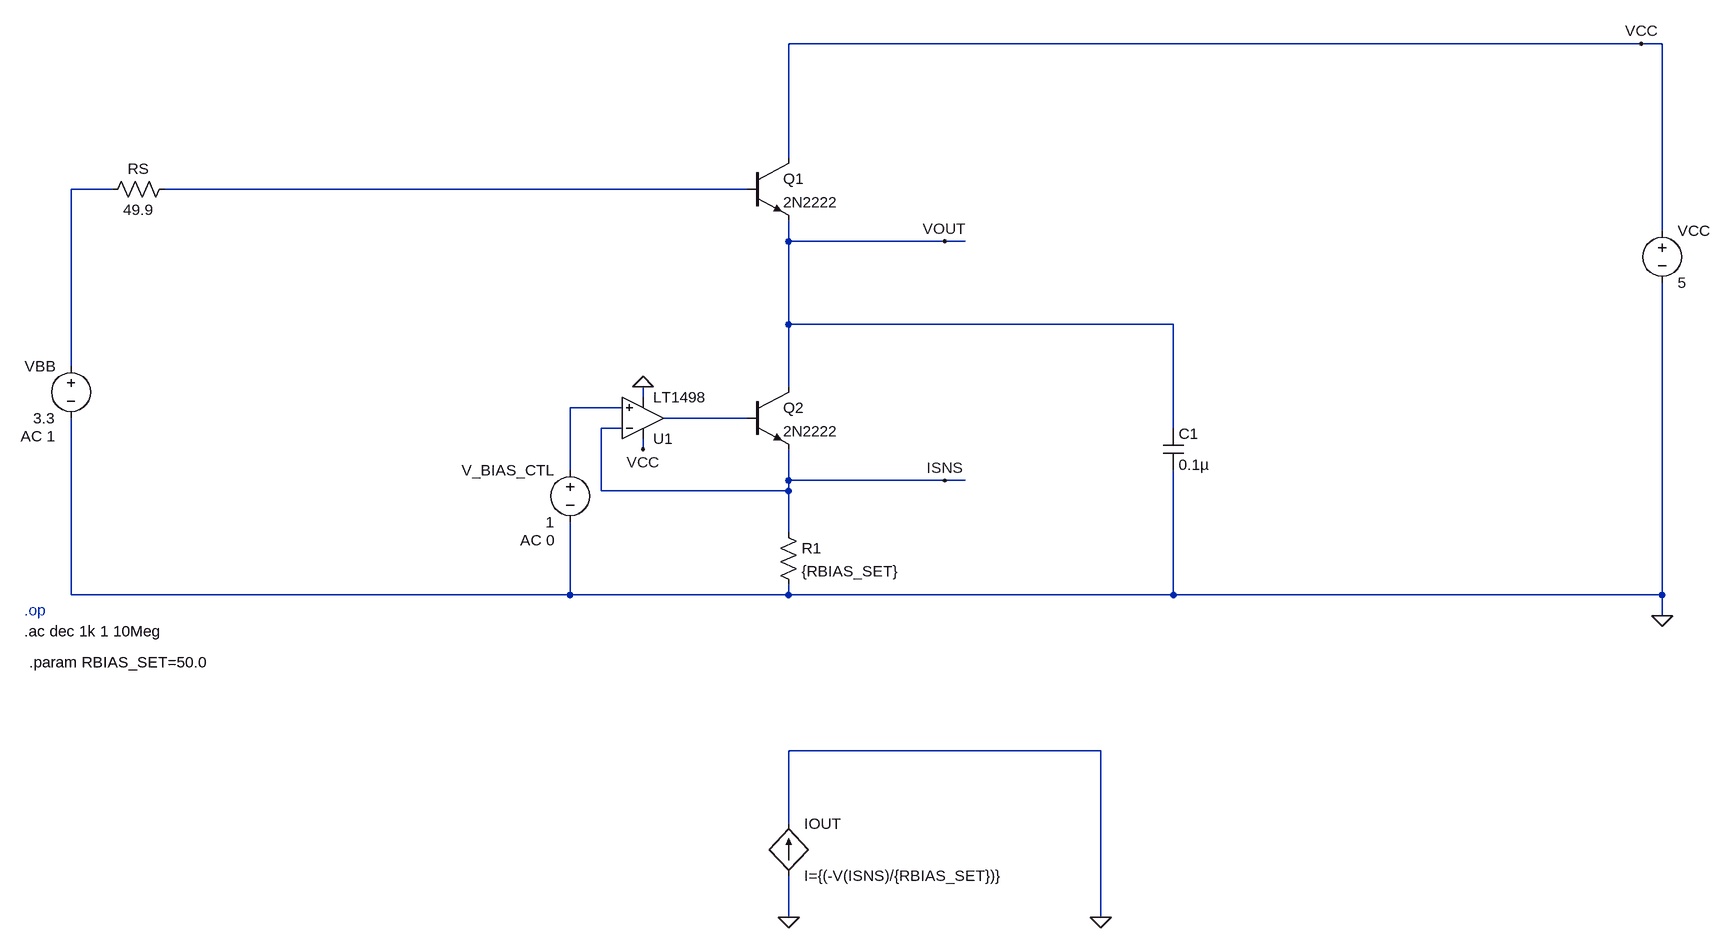
[diagram p0: schematic Emitter_Follower_Output_Impedance_Measurement.asc]
Emitter_Follower_Output_Impedance_Measurement.asc, the LTspice schematic file:
Version 4.1
SHEET 1 1352 980
WIRE 1248 -384 -64 -384
WIRE 1280 -384 1248 -384
WIRE -64 -208 -64 -384
WIRE -1104 -160 -1168 -160
WIRE -128 -160 -1024 -160
WIRE 1280 -96 1280 -384
WIRE -64 -80 -64 -112
WIRE 176 -80 -64 -80
WIRE 208 -80 176 -80
WIRE -64 48 -64 -80
WIRE 528 48 -64 48
WIRE -1168 112 -1168 -160
WIRE -64 144 -64 48
WIRE -288 160 -288 144
WIRE -320 176 -400 176
WIRE -128 192 -256 192
WIRE -320 208 -352 208
WIRE 528 208 528 48
WIRE -288 240 -288 224
WIRE -400 272 -400 176
WIRE -64 288 -64 240
WIRE 176 288 -64 288
WIRE 208 288 176 288
WIRE -352 304 -352 208
WIRE -64 304 -64 288
WIRE -64 304 -352 304
WIRE -64 368 -64 304
WIRE -1168 464 -1168 192
WIRE -400 464 -400 352
WIRE -400 464 -1168 464
WIRE -64 464 -64 448
WIRE -64 464 -400 464
WIRE 528 464 528 272
WIRE 528 464 -64 464
WIRE 1280 464 1280 -16
WIRE 1280 464 528 464
WIRE 1280 496 1280 464
WIRE 416 704 -64 704
WIRE -64 816 -64 704
WIRE -64 960 -64 896
WIRE 416 960 416 704
FLAG 1280 496 0
FLAG 1248 -384 VCC
FLAG -288 240 VCC
FLAG -288 144 0
FLAG 176 -80 VOUT
FLAG -64 960 0
FLAG 176 288 ISNS
FLAG 416 960 0
DATAFLAG -800 -160 ""
DATAFLAG 48 -80 ""
DATAFLAG -160 304 ""
SYMBOL voltage -1168 96 M0
WINDOW 123 24 124 Left 2
WINDOW 39 0 0 Left 0
SYMATTR InstName VBB
SYMATTR Value 3.3
SYMATTR Value2 AC 1
SYMBOL voltage 1280 -112 R0
WINDOW 123 0 0 Left 0
WINDOW 39 0 0 Left 0
SYMATTR InstName VCC
SYMATTR Value 5
SYMBOL res -80 352 R0
SYMATTR InstName R1
SYMATTR Value {RBIAS_SET}
SYMBOL OpAmps\\LT1498 -288 256 M180
SYMATTR InstName U1
SYMBOL voltage -400 256 M0
WINDOW 123 24 124 Left 2
WINDOW 39 0 0 Left 0
SYMATTR InstName V_BIAS_CTL
SYMATTR Value 1
SYMATTR Value2 AC 0
SYMBOL res -1120 -144 R270
WINDOW 0 32 56 VTop 2
WINDOW 3 0 56 VBottom 2
SYMATTR InstName RS
SYMATTR Value 49.9
SYMBOL bi -64 896 M180
WINDOW 0 24 80 Left 2
WINDOW 3 24 0 Left 2
SYMATTR InstName IOUT
SYMATTR Value I={(-V(ISNS)/{RBIAS_SET})}
SYMBOL cap 512 208 R0
SYMATTR InstName C1
SYMATTR Value 0.1µ
SYMBOL npn -128 -208 R0
SYMATTR InstName Q1
SYMATTR Value 2N2222
SYMBOL npn -128 144 R0
SYMATTR InstName Q2
SYMATTR Value 2N2222
TEXT -1240 520 Left 2 !.ac dec 1k 1 10Meg
TEXT -1240 488 Left 2 ;.op
TEXT -1232 568 Left 2 !.param RBIAS_SET=50.0

The netlist it stands for:
* Emitter_Follower_Output_Impedance_Measurement.asc
VBB N001 0 3.3 AC 1
VCC VCC 0 5
R1 ISNS 0 {RBIAS_SET}
X§U1 N003 ISNS VCC 0 N004 LT1498  ; pins In+ In- V+ V- OUT
V_BIAS_CTL N003 0 1 AC 0
RS N001 N002 49.9
B§IOUT 0 0 I={(-V(ISNS)/{RBIAS_SET})}
C1 VOUT 0 0.1µ
Q1 VCC N002 VOUT 0 2N2222
Q2 VOUT N004 ISNS 0 2N2222
.model NPN NPN
.model PNP PNP
.lib standard.bjt
.ac dec 1k 1 10Meg
* .op
.param RBIAS_SET=50.0
.lib LTC.lib
.backanno
.end